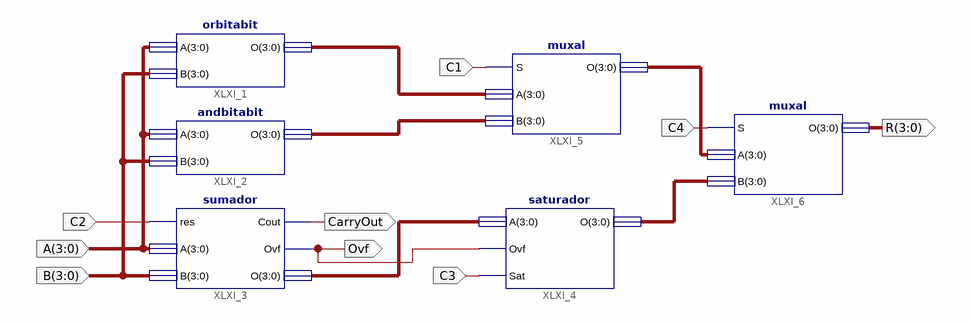
[diagram p0: schematic sheet 1]
// Xilinx ISE schematic ALU.sch (spartan3) as structural Verilog: 6 symbols, 9 ports
module ALU (
  input  C3,
  input  C1,
  input  C2,
  input  C4,
  input  [3:0] A,
  input  [3:0] B,
  output CarryOut,
  output Ovf,
  output [3:0] R
);

  wire [3:0] XLXN_7, XLXN_8, XLXN_9, XLXN_10, XLXN_11;

  orbitabit XLXI_1 (.A(A), .B(B), .O(XLXN_9));
  andbitabit XLXI_2 (.A(A), .B(B), .O(XLXN_8));
  sumador XLXI_3 (.res(C2), .A(A), .B(B), .Cout(CarryOut), .Ovf(Ovf), .O(XLXN_7));
  saturador XLXI_4 (.A(XLXN_7), .O(XLXN_11), .Ovf(Ovf), .Sat(C3));
  muxal XLXI_5 (.S(C1), .A(XLXN_9), .B(XLXN_8), .O(XLXN_10));
  muxal XLXI_6 (.S(C4), .A(XLXN_10), .B(XLXN_11), .O(R));
endmodule
